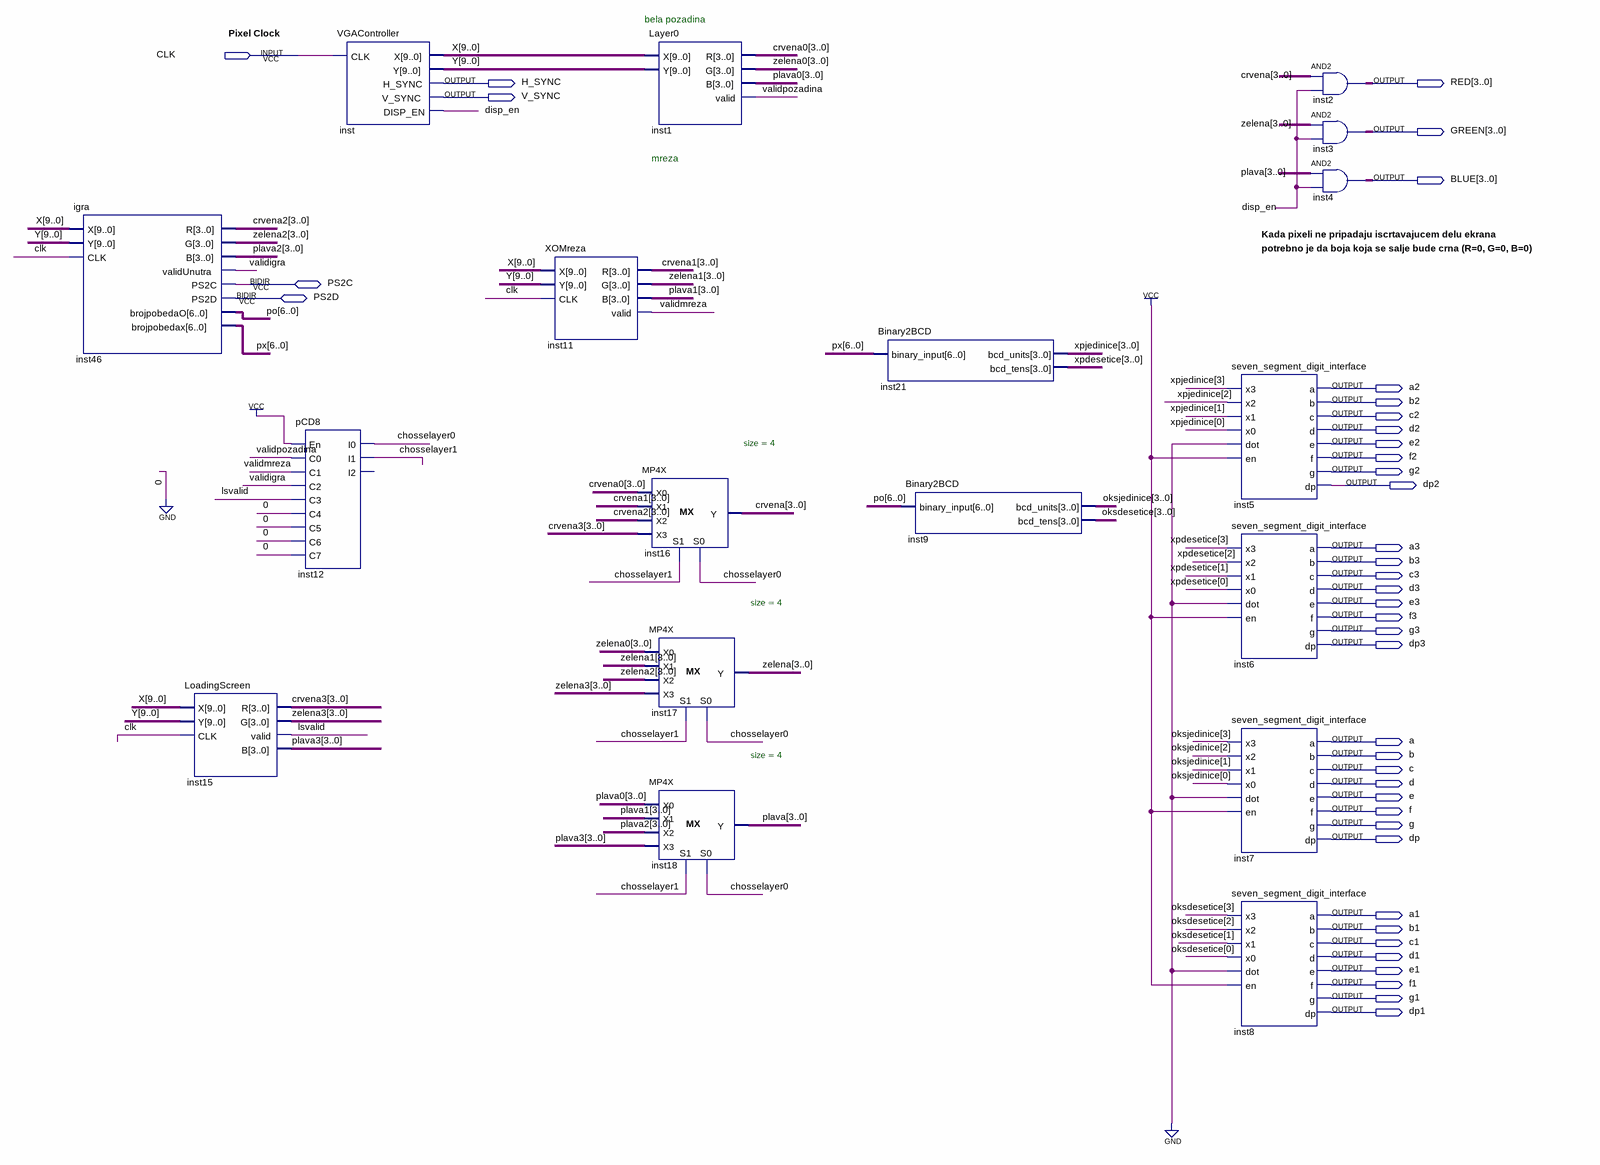
[diagram p0: schematic sheet]
// Quartus schematic Lab2Demo.bdf as structural Verilog: 18 symbols, 40 pins
module Lab2Demo (
  input  CLK,
  inout  PS2C,
  inout  PS2D,
  output H_SYNC,
  output [3:0] RED,
  output V_SYNC,
  output [3:0] GREEN,
  output [3:0] BLUE,
  output a2,
  output b2,
  output c2,
  output d2,
  output e2,
  output f2,
  output g2,
  output dp2,
  output a3,
  output b3,
  output c3,
  output d3,
  output e3,
  output f3,
  output g3,
  output dp3,
  output a,
  output b,
  output c,
  output d,
  output e,
  output f,
  output g,
  output dp,
  output a1,
  output b1,
  output c1,
  output d1,
  output e1,
  output f1,
  output g1,
  output dp1
);

  wire chosselayer0, chosselayer1, disp_en, lsvalid, validigra, validmreza, validpozadina;
  wire [3:0] crvena, crvena0, crvena1, crvena2, crvena3, oksdesetice, oksjedinice, plava, plava0, plava1,
       plava2, plava3, xpdesetice, xpjedinice, zelena, zelena0, zelena1, zelena2, zelena3;
  wire [6:0] po, px;
  wire [9:0] X, Y;

  igra inst46 (
    .X(X), .Y(Y), .CLK(CLK), .R(crvena2), .G(zelena2), .B(plava2), .validUnutra(validigra), .brojpobedaO(po),
    .brojpobedax(px), .PS2C(PS2C), .PS2D(PS2D));
  LoadingScreen inst15 (.X(X), .Y(Y), .CLK(CLK), .R(crvena3), .G(zelena3), .valid(lsvalid), .B(plava3));
  VGAController inst (.CLK(CLK), .X(X), .Y(Y), .H_SYNC(H_SYNC), .V_SYNC(V_SYNC), .DISP_EN(disp_en));
  pCD8 inst12 (
    .En(1'b1), .C0(validpozadina), .C1(validmreza), .C2(validigra), .C3(lsvalid), .C4(1'b0), .C5(1'b0),
    .C6(1'b0), .C7(1'b0), .I0(chosselayer0), .I1(chosselayer1));  // open: I2
  XOMreza inst11 (.X(X), .Y(Y), .CLK(CLK), .R(crvena1), .G(zelena1), .B(plava1), .valid(validmreza));
  Layer0 inst1 (.X(X), .Y(Y), .R(crvena0), .G(zelena0), .B(plava0), .valid(validpozadina));
  MP4X #(.size(4)) inst16 (
    .S0(chosselayer0), .S1(chosselayer1), .X0(crvena0), .X1(crvena1), .X2(crvena2), .X3(crvena3), .Y(crvena));
  MP4X #(.size(4)) inst17 (
    .S0(chosselayer0), .S1(chosselayer1), .X0(zelena0), .X1(zelena1), .X2(zelena2), .X3(zelena3), .Y(zelena));
  MP4X #(.size(4)) inst18 (
    .S0(chosselayer0), .S1(chosselayer1), .X0(plava0), .X1(plava1), .X2(plava2), .X3(plava3), .Y(plava));
  Binary2BCD inst21 (.binary_input(px), .bcd_units(xpjedinice), .bcd_tens(xpdesetice));
  Binary2BCD inst9 (.binary_input(po), .bcd_units(oksjedinice), .bcd_tens(oksdesetice));
  seven_segment_digit_interface inst5 (
    .x3(xpjedinice[3]), .x2(xpjedinice[2]), .x1(xpjedinice[1]), .x0(xpjedinice[0]), .dot(1'b0), .en(1'b1),
    .a(a2), .b(b2), .c(c2), .d(d2), .e(e2), .f(f2), .g(g2), .dp(dp2));
  seven_segment_digit_interface inst6 (
    .x3(xpdesetice[3]), .x2(xpdesetice[2]), .x1(xpdesetice[1]), .x0(xpdesetice[0]), .dot(1'b0), .en(1'b1),
    .a(a3), .b(b3), .c(c3), .d(d3), .e(e3), .f(f3), .g(g3), .dp(dp3));
  seven_segment_digit_interface inst7 (
    .x3(oksjedinice[3]), .x2(oksjedinice[2]), .x1(oksjedinice[1]), .x0(oksjedinice[0]), .dot(1'b0),
    .en(1'b1), .a(a), .b(b), .c(c), .d(d), .e(e), .f(f), .g(g), .dp(dp));
  seven_segment_digit_interface inst8 (
    .x3(oksdesetice[3]), .x2(oksdesetice[2]), .x1(oksdesetice[1]), .x0(oksdesetice[0]), .dot(1'b0),
    .en(1'b1), .a(a1), .b(b1), .c(c1), .d(d1), .e(e1), .f(f1), .g(g1), .dp(dp1));
  assign RED = crvena & {4{disp_en}};  // AND2 inst2, 4 bits wide
  assign GREEN = zelena & {4{disp_en}};  // AND2 inst3, 4 bits wide
  assign BLUE = plava & {4{disp_en}};  // AND2 inst4, 4 bits wide

  // Notes on the sheet:
  //   bela pozadina
  //   Pixel Clock
  //   mreza
  //   Kada pixeli ne pripadaju iscrtavajucem delu ekrana
  //   potrebno je da boja koja se salje bude crna (R=0, G=0, B=0)
endmodule
